# Altium schematic sheet Battery-management.SchDoc
size A4; SheetNumber: 2; SheetTotal: 6
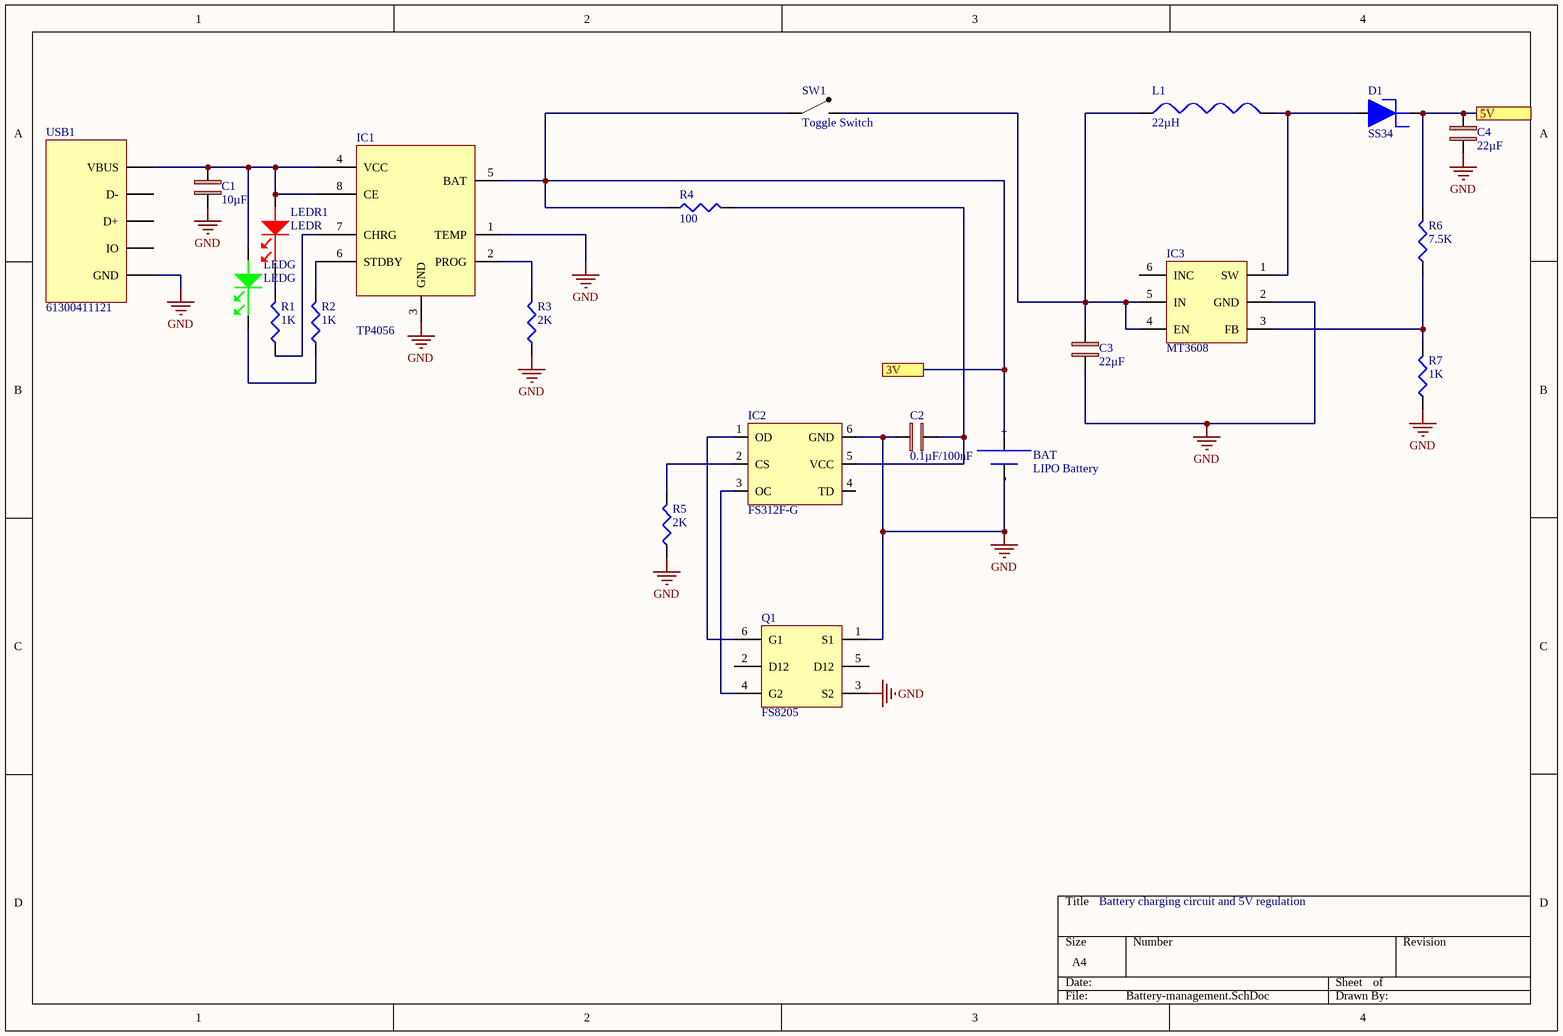
[diagram p0: Battery-management.SchDoc]

## Parts
BAT  LIPO Battery  [LIPO battery pads]
C1  10µF  [ELCO]
C2  0.1µF/100nF  [MC0603B104K250CT]
C3  22µF  [1210ZC226KAT2A]
C4  22µF  [1210ZC226KAT2A]
D1  SS34  [1N5822]
IC1  TP4056  [HSOP08]
IC2  FS312F-G  [SOT95P280X145-6N]
IC3  MT3608  [SOT23-6]
L1  22µH  [MLZ1608]
LEDG  LEDG  [KPT-3216SGC]
LEDR1  LEDR  [LSQ976-Z]
Q1  FS8205  [SOT95P280X145-6N]
R1  1K  [RK73H-0603]
R2  1K  [RK73H-0603]
R3  2K  [RC0603FR-072KL]
R4  100  [CRGP2512]
R5  2K  [RC0603FR-072KL]
R6  7.5K  [RC0603FR-072KL]
R7  1K  [RK73H-0603]
SW1  Toggle Switch  [SMD Switch]
USB1  61300411121  [Micro USB - Type B]

## Ports
3V, 5V

## Nets
GND: BAT.2(-) C1.2 C2.2 C3.2 C4.2 IC1.1(TEMP) IC1.3(GND) IC2.6(GND) IC3.2(GND) Q1.1(S1) Q1.3(S2) R3.1 R5.1 R7.1 USB1.5(GND)
3V: BAT.1(+) IC1.5(BAT) R4.2 SW1.1 ; port 3V
5V: C4.1 D1.2 R6.2 ; port 5V
NetC1_1: C1.1 IC1.4(VCC) IC1.8(CE) LEDG.1(+) LEDR1.1(+) USB1.1(VBUS)
NetC2_1: C2.1 IC2.5(VCC) R4.1
NetC3_1: C3.1 IC3.4(EN) IC3.5(IN) L1.1 SW1.2
NetD1_1: D1.1 IC3.1(SW) L1.2
NetIC1_2: IC1.2(PROG) R3.2
NetIC1_6: IC1.6(STDBY) R2.1
NetIC1_7: IC1.7(CHRG) R1.1
NetIC2_1: IC2.1(OD) Q1.6(G1)
NetIC2_2: IC2.2(CS) R5.2
NetIC2_3: IC2.3(OC) Q1.4(G2)
NetIC3_3: IC3.3(FB) R6.1 R7.2
NetLEDG_2: LEDG.2 R2.2
NetLEDR1_2: LEDR1.2 R1.2

Not connected (* = marked no-connect by the designer): IC2 4(TD); IC3 6(INC); Q1 2(D12) 5(D12); USB1 2(D-) 3(D+) 4(IO)

## Notes on the sheet
- Battery charging circuit and 5V regulation

## Library data of the parts
BAT = 103040 LIPO battery
C1 = 35TZV10M4X6.1: RUBYCON - 35TZV10M4X6.1 - KONDENSATOR, 10µF, 35V, RADIAL, SMD; Capacitance: 10uF; Tolerance: 20%; Ripple Current: 90mA; Impedance: 1.45R; Life (Hours): 2000Hour; Supplier 1: Newark; Manufacturer: Rubycon; Manufacturer Part Number: 35TZV10M4X6.1; RoHS: Yes; Category: Aluminum Electrolytic Capacitors; Stock 1: 365; Pricing 1: 5=0,37000, 10=0,25400, 25=0,21600, 50=0,17800, 100=0,15200 (USD); Mount: Surface Mount; Case/Package: Radial; Number of Pins: 2; Min Operating Temperature: -55°C; Max Operating Temperature: 105°C; Ripple Current (AC): 90mA; Packaging: Cut Tape; Package Quantity: 2000; Voltage Rating: 35V; Voltage Rating (DC): 35V; Series: TZV; Construction: Cylindrical; Diameter: 4mm; Height: 6.1mm; Height - Seated (Max): 0.24inch; Radiation Hardening: No; REACH SVHC: No SVHC; Lead Free: Lead Free; RoHS Compliant: Yes; ComponentLink1URL: https://datasheet.ciiva.com/26878/getdatasheetpartid-443596-26878330.pdf?src-supplier=Verical; ComponentLink1Description: https://datasheet.ciiva.com/26878/getdatasheetpartid-443596-26878330.pdf?src-supplier=Verical; ComponentLink2URL: https://datasheet.ciiva.com/17514/e-tzv-17514469.pdf?src-supplier=Avnet+Europe; ComponentLink2Description: https://datasheet.ciiva.com/17514/e-tzv-17514469.pdf?src-supplier=Avnet+Europe; ComponentLink3URL: https://datasheet.ciiva.com/22732/1725814-22732219.pdf?src-supplier=Element14; ComponentLink3Description: https://datasheet.ciiva.com/22732/1725814-22732219.pdf?src-supplier=Element14; Supplier Part Number 1: 08X5009
C2 = MC0603B104K250CT: Cap Ceramic 0.1uF 25V X7R 10% Pad SMD 0603 125C T/R; Manufacturer: Multicomp; Capacitance: 100nF; Supplier 1: Newark; Manufacturer Part Number: MC0603B104K250CT; RoHS: Yes; Category: Ceramic Capacitors; Stock 1: 124000; Pricing 1: 1=0,00300, 4000=0,00300, 8000=0,00300, 20000=0,00300 (USD); Case/Package: 0603; Number of Pins: 2; Case Code (Metric): 1608; Case Code (Imperial): 0603; Min Operating Temperature: -55°C; Max Operating Temperature: 125°C; Tolerance: 10%; Packaging: Cut Tape; Voltage Rating: 25V; Dielectric: X7R; Voltage Rating (DC): 25V; Series: MLCC; Width: 0.8mm; REACH SVHC: Unknown; RoHS Compliant: Yes; ComponentLink1URL: https://datasheet.ciiva.com/22686/1901289-22686277.pdf?src-supplier=Element14; ComponentLink1Description: https://datasheet.ciiva.com/22686/1901289-22686277.pdf?src-supplier=Element14; ComponentLink2URL: https://datasheet.ciiva.com/22648/1901289-22648410.pdf?src-supplier=Element14; ComponentLink2Description: https://datasheet.ciiva.com/22648/1901289-22648410.pdf?src-supplier=Element14; Supplier Part Number 1: 94W8728
C3 C4 = 1210ZC226KAT2A: 1210 22 uF 10 V ±10 % Tolerance X7R Surface Mount Multilayer Ceramic Capacitor; Manufacturer: Kyocera AVX; Capacitance: 22uF; Tolerance: 10%; Voltage Rating: 10V; Supplier 1: Newark; Manufacturer Part Number: 1210ZC226KAT2A; RoHS: Yes; Category: Ceramic Capacitors; Stock 1: 240; Pricing 1: 1=1,79000, 10=1,46000, 25=1,36000 (USD); Mount: Surface Mount; Case/Package: 1210; Number of Pins: 2; Case Code (Imperial): 1210; Case Code (Metric): 3225; Min Operating Temperature: -55°C; Max Operating Temperature: 125°C; Dielectric: X7R; Packaging: Tape and Reel; Package Quantity: 1; Termination: SMD/SMT; Voltage Rating (DC): 10V; Series: -; Voltage: 10V; Construction: Flat; Length: 3.2mm; Width: 0.098inch; Depth: 2.5mm; Thickness: 0.11inch; Radiation Hardening: No; REACH SVHC: Unknown; Lead Free: Lead Free; RoHS Compliant: Yes; ComponentLink1URL: https://datasheet.ciiva.com/11499/cx7r-11499965.pdf?src-supplier=Avnet; ComponentLink1Description: https://datasheet.ciiva.com/11499/cx7r-11499965.pdf?src-supplier=Avnet; ComponentLink2URL: https://datasheet.ciiva.com/28592/1679506-28592703.pdf?src-supplier=Element14; ComponentLink2Description: https://datasheet.ciiva.com/28592/1679506-28592703.pdf?src-supplier=Element14; ComponentLink3URL: https://datasheet.ciiva.com/5421/cx7r-5421062.pdf?src-supplier=Mouser; ComponentLink3Description: https://datasheet.ciiva.com/5421/cx7r-5421062.pdf?src-supplier=Mouser; ComponentLink4URL: https://datasheet.ciiva.com/14887/cx7r-14887591.pdf?src-supplier=Digi-Key; ComponentLink4Description: https://datasheet.ciiva.com/14887/cx7r-14887591.pdf?src-supplier=Digi-Key; ComponentLink5URL: https://datasheet.ciiva.com/28592/1679506-28592903.pdf?src-supplier=Element14; ComponentLink5Description: https://datasheet.ciiva.com/28592/1679506-28592903.pdf?src-supplier=Element14; ComponentLink6URL: https://datasheet.ciiva.com/14887/cx7r-14887593.pdf?src-supplier=Digi-Key; ComponentLink6Description: https://datasheet.ciiva.com/14887/cx7r-14887593.pdf?src-supplier=Digi-Key; ComponentLink7URL: https://datasheet.ciiva.com/7614/cx7r-7614701.pdf?src-supplier=Digi-Key; ComponentLink7Description: https://datasheet.ciiva.com/7614/cx7r-7614701.pdf?src-supplier=Digi-Key; ComponentLink8URL: https://datasheet.ciiva.com/11499/cx7r-11499966.pdf?src-supplier=Avnet; ComponentLink8Description: https://datasheet.ciiva.com/11499/cx7r-11499966.pdf?src-supplier=Avnet; ComponentLink9URL: https://datasheet.ciiva.com/16301/cx7r-16301534.pdf?src-supplier=Future+Electronics; ComponentLink9Description: https://datasheet.ciiva.com/16301/cx7r-16301534.pdf?src-supplier=Future+Electronics; Supplier Part Number 1: 95W9441
D1 = SS34-E3/57T: DIODE SCHOTTKY 40V 3A DO214AB; Manufacturer: Vishay Semiconductors; Forward Voltage: 500mV; Element Configuration: Single; Max Forward Surge Current (Ifsm): 100A; Max Reverse Current: 500uA; Polarity: Standard; Supplier 1: RSComponents; Manufacturer Part Number: SS34-E3/57T; RoHS: Yes; Category: Rectifier Diodes; Stock 1: 1120; Pricing 1: 20=0,52900, 180=0,38200, 420=0,36100 (USD); Mount: Surface Mount; Case/Package: SMC; Number of Pins: 2; Contact Plating: Tin,Matte; Min Operating Temperature: -55°C; Max Operating Temperature: 125°C; Packaging: Tape and Reel; Forward Current: 3A; Max Repetitive Reverse Voltage (Vrrm): 40V; Max Surge Current: 100A; Package Quantity: 1; Average Rectified Current: 3A; Max Reverse Leakage Current: 500uA; Peak Non-Repetitive Surge Current: 100A; Voltage Rating (DC): 40V; Current Rating: 3A; Output Current: 3A; Current: 3A; Voltage: 40V; Max Reverse Voltage (DC): 40V; Length: 7.11mm; Width: 6.22mm; Height: 2.417mm; Radiation Hardening: No; REACH SVHC: Unknown; Lead Free: Lead Free; ComponentLink1URL: https://datasheet.ciiva.com/15144/getdatasheetpartid-73598-15144471.pdf?src-supplier=Verical; ComponentLink1Description: https://datasheet.ciiva.com/15144/getdatasheetpartid-73598-15144471.pdf?src-supplier=Verical; ComponentLink2URL: https://datasheet.ciiva.com/4244/ss32-4244863.pdf?src-supplier=Arrow+Electronics; ComponentLink2Description: https://datasheet.ciiva.com/4244/ss32-4244863.pdf?src-supplier=Arrow+Electronics; ComponentLink3URL: https://datasheet.ciiva.com/17077/ss34-e3-57t-17077951.pdf?src-supplier=Allied+Electronics; ComponentLink3Description: https://datasheet.ciiva.com/17077/ss34-e3-57t-17077951.pdf?src-supplier=Allied+Electronics; ComponentLink4URL: https://datasheet.ciiva.com/26788/ss34-e3-57t-26788786.pdf?src-supplier=IIIC; ComponentLink4Description: https://datasheet.ciiva.com/26788/ss34-e3-57t-26788786.pdf?src-supplier=IIIC; ComponentLink5URL: https://datasheet.ciiva.com/26295/1697107-26295413.pdf?src-supplier=Element14; ComponentLink5Description: https://datasheet.ciiva.com/26295/1697107-26295413.pdf?src-supplier=Element14
IC2 = FS312F-G: Lithium battery protection IC; Category: Protection IC; Case/Package: SOT23-6
IC3 = MT3608: Voltage regulator; Case/Package: SOT23-6; Category: Voltage regulator
L1 = MLZ1608N220LT000: Inductor Power Shielded Multi-Layer 22uH 20% 2MHz Ferrite 0.05A 2.145Ohm DCR 0603 T/R; Manufacturer: TDK; Saturation Current: 50mA; DC Resistance (DCR): 2.145R; Current Rating: 300mA; Supplier 1: Arrow Electronics; Manufacturer Part Number: MLZ1608N220LT000; RoHS: Yes; Category: Fixed Inductors; Stock 1: 3800; Pricing 1: 1=0,15380, 10=0,10450, 25=0,10350, 100=0,08320, 250=0,08240, 500=0,07410, 1000=0,06230, 3000=0,06170 (USD); Mount: Surface Mount; Case/Package: 0603; Case Code (Metric): 1608; Case Code (Imperial): 0603; Core Material: Ferrite; Weight: 0.000141oz; Min Operating Temperature: -55°C; Max Operating Temperature: 125°C; Packaging: Tape and Reel; Inductance: 22uH; Package Quantity: 4000; Tolerance: 20%; Shielding: Shielded; Test Frequency: 2MHz; Termination: SMD/SMT; Length: 0.063inch; Width: 0.031inch; Height: 0.8mm; Height - Seated (Max): 0.037inch; Lead Free: Lead Free; RoHS Compliant: Yes; ComponentLink1URL: https://datasheet.ciiva.com/41832/inductor-commercial-decoupling-mlz-en-41832797.pdf?src-supplier=Digi-Key; ComponentLink1Description: https://datasheet.ciiva.com/41832/inductor-commercial-decoupling-mlz-en-41832797.pdf?src-supplier=Digi-Key; Supplier Part Number 1: MLZ1608N220LT000
LEDG = KPT-3216SGC: LED Uni-Color SB. Green 565nm 2-Pin Chip LED T/R; Manufacturer: Kingbright; Lens Color: Clear; Lens Style: Rectangular,Diffused,Colorless; Viewing Angle: 120°; Number of LEDs: 1; Luminous Intensity: 12mcd; Forward Voltage: 2.2V; Wavelength: 568nm; Forward Current: 20mA; Supplier 1: RSComponents; Manufacturer Part Number: KPT-3216SGC; RoHS: Yes; Category: LEDs; Stock 1: 1; Pricing 1: 100=0,14200, 500=0,13500, 1000=0,11800, 2000=0,10700, 8000=0,10500 (USD); Mount: Surface Mount; Case/Package: 3216; Number of Pins: 2; Color: Green; Packaging: Tape and Reel; Dominant Wavelength: 568nm; Series: 1206; Radiation Hardening: No; REACH SVHC: No SVHC; RoHS Compliant: Yes; ComponentLink1URL: https://datasheet.ciiva.com/23674/1563720-23674567.pdf?src-supplier=Newark; ComponentLink1Description: https://datasheet.ciiva.com/23674/1563720-23674567.pdf?src-supplier=Newark; Supplier Part Number 1: 8610204P
LEDR1 = LSQ976-Z: Led, SMD, Red, 180MCD, 633NM; Manufacturer: Osram Opto; Forward Current: 20mA; Viewing Angle: 160°; Forward Voltage: 2V; Lens Style: Rectangular,Diffused,Colorless; Number of LEDs: 1; Supplier 1: Avnet; Manufacturer Part Number: LSQ976-Z; RoHS: Yes; Category: LEDs; Mount: Surface Mount; Number of Pins: 2; Color: Red; Dominant Wavelength: 633nm; Wavelength: 633nm; Luminous Intensity: 180mcd; Packaging: Cut Tape; REACH SVHC: No SVHC; ComponentLink1URL: https://datasheet.ciiva.com/8060/24682-8060069.pdf?src-supplier=Element14; ComponentLink1Description: https://datasheet.ciiva.com/8060/24682-8060069.pdf?src-supplier=Element14; ComponentLink2URL: https://datasheet.ciiva.com/8060/24682-8060070.pdf?src-supplier=Element14; ComponentLink2Description: https://datasheet.ciiva.com/8060/24682-8060070.pdf?src-supplier=Element14; Supplier Part Number 1: LSQ976-Z
Q1 = FS8205: Dual N-Channel Enhancement Mode Power MOSFET; Case/Package: SOT23-6
R1 R2 R7 = RK73H1JTTD1001F: 1KΩ ±1% 1/8W ±100ppm/℃ 0603; Manufacturer: KOA Speer; Voltage Rating: 75V; Power Rating: 125mW; Resistance: 1kR; Temperature Coefficient: 100ppm/°C; Voltage Rating (DC): 50V; Supplier 1: Arrow Electronics; Manufacturer Part Number: RK73H1JTTD1001F; RoHS: Yes; Category: Resistors; Stock 1: 1; Pricing 1: 1=0,04800 (USD); Case/Package: 0603; Number of Pins: 2; Case Code (Imperial): 0603; Case Code (Metric): 1608; Weight: 0.000811oz; Min Operating Temperature: -55°C; Max Operating Temperature: 155°C; Packaging: Cut Tape; Package Quantity: 5000; Tolerance: 1%; Resistor Type: Thick Film; Termination: SMD/SMT; Series: RK73H; Technology: THICK FILM; Length: 1.6mm; Width: 0.8mm; Height: 0.45mm; Depth: 0.8mm; Military Standard: Not; REACH SVHC: Unknown; Lead Free: Lead Free; RoHS Compliant: Yes; ComponentLink1URL: https://datasheet.ciiva.com/15159/getdatasheetpartid-87490-15159861.pdf?src-supplier=Verical; ComponentLink1Description: https://datasheet.ciiva.com/15159/getdatasheetpartid-87490-15159861.pdf?src-supplier=Verical; ComponentLink2URL: https://datasheet.ciiva.com/48426/rk73h-series-eng-jap-tds-48426519.pdf?src-supplier=Distrelec; ComponentLink2Description: https://datasheet.ciiva.com/48426/rk73h-series-eng-jap-tds-48426519.pdf?src-supplier=Distrelec; Supplier Part Number 1: RK73H1JTTD1001F
R3 R5 = RC0603FR-072KL: 2000Ω ± 1.00% 0.1W ± 100ppm/℃ 0603; Manufacturer: Yageo; Resistance: 2kR; Tolerance: 1%; Temperature Coefficient: 100ppm/°C; Voltage Rating (DC): 50V; Power Rating: 100mW; Working Voltage: 75V; Supplier 1: RSComponents; Manufacturer Part Number: RC0603FR-072KL; RoHS: Yes; Category: Resistors; Stock 1: 1700; Pricing 1: 5000=0,00400, 10000=0,00300, 15000=0,00300, 20000=0,00300 (GBP); Case/Package: 0603; Number of Pins: 2; Case Code (Metric): 1608; Case Code (Imperial): 0603; Min Operating Temperature: -55°C; Max Operating Temperature: 155°C; Resistor Type: Thick Film; Packaging: Tape and Reel; Voltage Rating: 50V; Package Quantity: 1; Number of Terminations: 2; Termination: SMD/SMT; Max Power Dissipation: 100mW; Features: Moisture Resistant; Series: RC; Resistance Tolerance: 1%; Technology: THICK FILM; Construction: Rectangular; Length: 1.6mm; Width: 0.031inch; Height: 0.45mm; Depth: 0.8mm; Lead Free: Lead Free; REACH SVHC: No SVHC; Military Standard: Not; RoHS Compliant: Yes; ComponentLink1URL: https://datasheet.ciiva.com/11808/0900766b80f96399-11808134.pdf?src-supplier=RSComponents; ComponentLink1Description: https://datasheet.ciiva.com/11808/0900766b80f96399-11808134.pdf?src-supplier=RSComponents; ComponentLink2URL: https://datasheet.ciiva.com/22747/443971-22747526.pdf?src-supplier=Element14; ComponentLink2Description: https://datasheet.ciiva.com/22747/443971-22747526.pdf?src-supplier=Element14; ComponentLink3URL: https://datasheet.ciiva.com/2453/pyu-r-int-thick-7-2453913.pdf?src-supplier=Digi-Key; ComponentLink3Description: https://datasheet.ciiva.com/2453/pyu-r-int-thick-7-2453913.pdf?src-supplier=Digi-Key; ComponentLink4URL: https://datasheet.ciiva.com/12555/rc0603-272842-12555257.pdf?src-supplier=Mouser; ComponentLink4Description: https://datasheet.ciiva.com/12555/rc0603-272842-12555257.pdf?src-supplier=Mouser; ComponentLink5URL: https://datasheet.ciiva.com/2453/pyu-r-int-thick-7-2453914.pdf?src-supplier=Digi-Key; ComponentLink5Description: https://datasheet.ciiva.com/2453/pyu-r-int-thick-7-2453914.pdf?src-supplier=Digi-Key; ComponentLink6URL: https://datasheet.ciiva.com/2453/pyu-r-int-thick-7-2453915.pdf?src-supplier=Digi-Key; ComponentLink6Description: https://datasheet.ciiva.com/2453/pyu-r-int-thick-7-2453915.pdf?src-supplier=Digi-Key; Supplier Part Number 1: 1995523
R4 = CRGP2512F100R: Res Thick Film 2512 100 Ohm 1% 2W ±100ppm/C Pad SMD T/R; Manufacturer: TE Connectivity; Resistance: 100R; Temperature Coefficient: 200ppm/°C; Supplier 1: RSComponents; Manufacturer Part Number: CRGP2512F100R; RoHS: Yes; Category: Resistors; Stock 1: 1; Pricing 1: 4000=0,10900, 12000=0,10100, 20000=0,09100 (USD); Case/Package: 2512; Case Code (Imperial): 2512; Case Code (Metric): 6432; Min Operating Temperature: -55°C; Max Operating Temperature: 155°C; Resistor Type: Thick Film; Packaging: Cut Tape; Tolerance: 1%; Max Power Dissipation: 2W; Number of Terminations: 2; RoHS Compliant: Yes; ComponentLink1URL: https://4donline.ihs.com/images/VipMasterIC/IC/TYEL/TYEL-S-A0005460475/TYEL-S-A0005460475-1.pdf?hkey=52A5661711E402568146F3353EA87419&src-supplier=Farnell; ComponentLink1Description: https://4donline.ihs.com/images/VipMasterIC/IC/TYEL/TYEL-S-A0005460475/TYEL-S-A0005460475-1.pdf?hkey=52A5661711E402568146F3353EA87419&src-supplier=Farnell; ComponentLink2URL: https://www.te.com/commerce/DocumentDelivery/DDEController?Action=srchrtrv&amp;DocNm=9-1773463-9&amp;DocType=DS&amp;DocLang=English&src-supplier=Digi-Key; ComponentLink2Description: https://www.te.com/commerce/DocumentDelivery/DDEController?Action=srchrtrv&amp;DocNm=9-1773463-9&amp;DocType=DS&amp;DocLang=English&src-supplier=Digi-Key; ComponentLink3URL: https://4donline.ihs.com/images/VipMasterIC/IC/TYEL/TYEL-S-A0005460475/TYEL-S-A0005460475-1.pdf?hkey=52A5661711E402568146F3353EA87419&src-supplier=Newark; ComponentLink3Description: https://4donline.ihs.com/images/VipMasterIC/IC/TYEL/TYEL-S-A0005460475/TYEL-S-A0005460475-1.pdf?hkey=52A5661711E402568146F3353EA87419&src-supplier=Newark; Supplier Part Number 1: 1764326
R6 = RC0603FR-077K5L: 7500Ω ± 1.00% 0.1W ± 100ppm/℃ 0603; Manufacturer: Yageo; Resistance: 7.5kR; Power Rating: 100mW; Tolerance: 1%; Voltage Rating: 50V; Temperature Coefficient: 100ppm/°C; Working Voltage: 75V; Supplier 1: Newark; Manufacturer Part Number: RC0603FR-077K5L; RoHS: Yes; Category: Chip SMD Resistors; Stock 1: 2709; Pricing 1: 1=0,10000, 25=0,01800, 50=0,01300, 100=0,00700 (USD); Case/Package: 0603; Number of Pins: 2; Case Code (Metric): 1608; Case Code (Imperial): 0603; Min Operating Temperature: -55°C; Max Operating Temperature: 155°C; Package Quantity: 1; Packaging: Tape and Reel; Resistor Type: Thick Film; Number of Terminations: 2; Termination: SMD/SMT; Max Power Dissipation: 100mW; Voltage Rating (DC): 50V; Features: Moisture Resistant; Series: RC; Technology: THICK FILM; Construction: Rectangular; Resistance Tolerance: 1%; Length: 1.6mm; Width: 0.031inch; Height: 0.45mm; Depth: 0.8mm; RoHS Compliant: Yes; REACH SVHC: No SVHC; Military Standard: Not; Lead Free: Lead Free; ComponentLink1URL: https://datasheet.ciiva.com/11808/0900766b80f96399-11808401.pdf?src-supplier=RSComponents; ComponentLink1Description: https://datasheet.ciiva.com/11808/0900766b80f96399-11808401.pdf?src-supplier=RSComponents; ComponentLink2URL: https://datasheet.ciiva.com/2519/pyu-r-int-thick-7-2519120.pdf?src-supplier=Digi-Key; ComponentLink2Description: https://datasheet.ciiva.com/2519/pyu-r-int-thick-7-2519120.pdf?src-supplier=Digi-Key; ComponentLink3URL: https://datasheet.ciiva.com/12555/rc0603-272842-12555256.pdf?src-supplier=Mouser; ComponentLink3Description: https://datasheet.ciiva.com/12555/rc0603-272842-12555256.pdf?src-supplier=Mouser; ComponentLink4URL: https://datasheet.ciiva.com/46395/443971-46395019.pdf?src-supplier=Element14; ComponentLink4Description: https://datasheet.ciiva.com/46395/443971-46395019.pdf?src-supplier=Element14; ComponentLink5URL: https://datasheet.ciiva.com/2519/pyu-r-int-thick-7-2519121.pdf?src-supplier=Digi-Key; ComponentLink5Description: https://datasheet.ciiva.com/2519/pyu-r-int-thick-7-2519121.pdf?src-supplier=Digi-Key; ComponentLink6URL: https://datasheet.ciiva.com/2519/pyu-r-int-thick-7-2519122.pdf?src-supplier=Digi-Key; ComponentLink6Description: https://datasheet.ciiva.com/2519/pyu-r-int-thick-7-2519122.pdf?src-supplier=Digi-Key; ComponentLink7URL: https://datasheet.ciiva.com/15189/getdatasheetpartid-326523-15189821.pdf?src-supplier=Verical; ComponentLink7Description: https://datasheet.ciiva.com/15189/getdatasheetpartid-326523-15189821.pdf?src-supplier=Verical; Supplier Part Number 1: 68R0113
SW1 = SK12D07VG3NS: C&K SK-12D07-VG 3 NS Switches > Slide > Miniature > Mini R/A Slide; Manufacturer: ITT C&K; Supplier 1: Digi-Key; Manufacturer Part Number: SK12D07VG3NS; RoHS: No; Category: Uncategorized; Pricing 1: 30000=0,24375 (USD); Package Quantity: 1000; ComponentLink1URL: http://www.mouser.com/ds/2/60/sk-965380.pdf?src-supplier=Mouser; ComponentLink1Description: http://www.mouser.com/ds/2/60/sk-965380.pdf?src-supplier=Mouser; ComponentLink2URL: https://www.ckswitches.com/media/1432/sk.pdf?src-supplier=Digi-Key; ComponentLink2Description: https://www.ckswitches.com/media/1432/sk.pdf?src-supplier=Digi-Key; Supplier Part Number 1: SK12D07VG3NS-ND
USB1 = 61300411121: CONN HEADER 4 POS 2.54; Manufacturer: Wurth Electronics; Number of Contacts: 4; Gender: Male; Connector Type: Male Pin; Pitch: 0.1inch; Supplier 1: RSComponents; Manufacturer Part Number: 61300411121; RoHS: Yes; Category: Headers and Wire Housings; Stock 1: 380; Pricing 1: 5=0,19600, 250=0,08000, 500=0,07800, 2500=0,07500, 5000=0,07200 (USD); Mount: Through Hole; Contact Material: Copper; Color: Black; Contact Plating: Gold; Number of Rows: 1; Packaging: Bulk; Termination: Solder; Number of Positions: 4; Contact Mating Length: 0.236inch; REACH SVHC: Unknown; RoHS Compliant: Yes; Lead Free: Lead Free; ComponentLink1URL: http://www.farnell.com/cad/1737268.pdf?src-supplier=Element14; ComponentLink1Description: http://www.farnell.com/cad/1737268.pdf?src-supplier=Element14; ComponentLink2URL: https://katalog.we-online.de/em/datasheet/6130xx11121.pdf?src-supplier=Digi-Key; ComponentLink2Description: https://katalog.we-online.de/em/datasheet/6130xx11121.pdf?src-supplier=Digi-Key; Supplier Part Number 1: 8281594
IC1 = TP4056: Category: Battery Management; Case/Package: ESOP8